# EAGLE schematic cassowari-original (EAGLE 9.2.2)
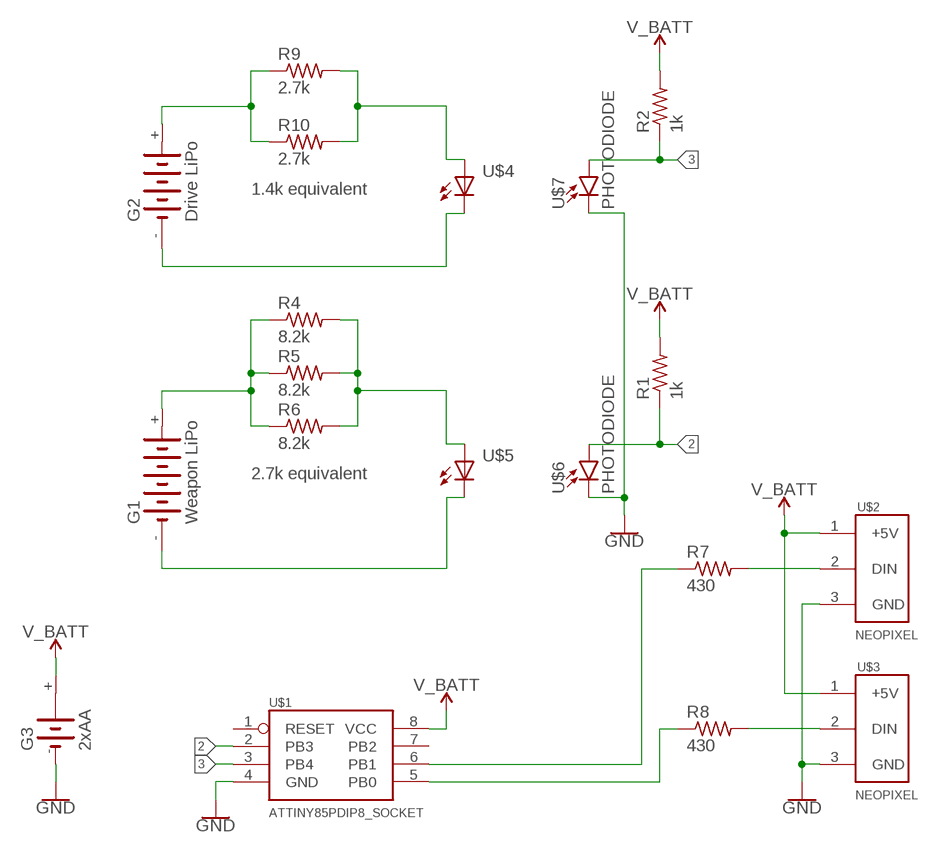
[diagram p0: schematic, sheet 1]

## Parts
G1  Weapon LiPo  NC2M  [NC2M]
G2  Drive LiPo  NC1M4V8  [NC1M]
G3  2xAA  NC2M2V4  [NC2M]
R1  1k  R-US_VMTA55  [VMTA55]
R2  1k  R-US_VMTA55  [VMTA55]
R4  8.2k  R-US_VMTA55  [VMTA55]
R5  8.2k  R-US_VMTA55  [VMTA55]
R6  8.2k  R-US_VMTA55  [VMTA55]
R7  430  R-US_VMTA55  [VMTA55]
R8  430  R-US_VMTA55  [VMTA55]
R9  2.7k  R-US_VMTA55  [VMTA55]
R10  2.7k  R-US_VMTA55  [VMTA55]
U$1  ATTINY85PDIP8_SOCKET  [SOCKET-08]
U$2  NEOPIXEL  [NEOPIXEL_PINHEAD]
U$3  NEOPIXEL  [NEOPIXEL_PINHEAD]
U$4  LED  [LED_3MM_HORIZ]
U$5  LED  [LED_3MM_HORIZ]
U$6  PHOTODIODE  [LED_3MM_HORIZ]
U$7  PHOTODIODE  [LED_3MM_HORIZ]

## Nets
2: R1.1 U$1.2(PB3) U$6.A
3: R2.1 U$1.3(PB4) U$7.A
GND: G3.- U$1.4(GND) U$2.3(GND) U$3.3(GND) U$6.K(C) U$7.K(C)
N$1: G1.- U$5.K
N$2: R7.2 U$2.2(DIN)
N$3: R8.2 U$3.2(DIN)
N$4: R9.2 R10.2 U$4.A
N$5: R4.2 R5.2 R6.2 U$5.A
N$6: G1.+ R4.1 R5.1 R6.1
N$7: G2.+ R9.1 R10.1
N$8: G2.- U$4.K
N$9: R8.1 U$1.5(PB0)
N$10: R7.1 U$1.6(PB1)
V_BATT: G3.+ R1.2 R2.2 U$1.8(VCC) U$2.1(+5V) U$3.1(+5V)
Unconnected: G1.+@1(+) G2.+@1(+) G3.+@1(+) U$1.1(RESET) U$1.7(PB2)

## Notes on the sheet
- 1.4k equivalent
- 2.7k equivalent

## Library data of the parts
G1 = battery:NC2M: NC ACCU Sonnenschein Memo NC-M 6.0V, grid 25.4mm
G2 = battery:NC1M4V8: NC ACCU Sonnenschein Mini-Memo NC-M 4.8V R5
G3 = battery:NC2M2V4: NC ACCU Sonnenschein Memo NC-M 2.4V, grid 25.4mm
R1 R2 R4-R10 = resistor:R-US_: RESISTOR, American symbol
U$1 = JoshCustom:ATTINY85: ATTiny85 microcontroller
U$2 U$3 = JoshCustom:NEOPIXEL
U$4 U$5 = JoshCustom:LED: LED
U$6 U$7 = JoshCustom:PHOTODIODE